# Altium schematic sheet Top.SchDoc
size B; DocumentNumber: 1; SheetNumber: 1; SheetTotal: 1
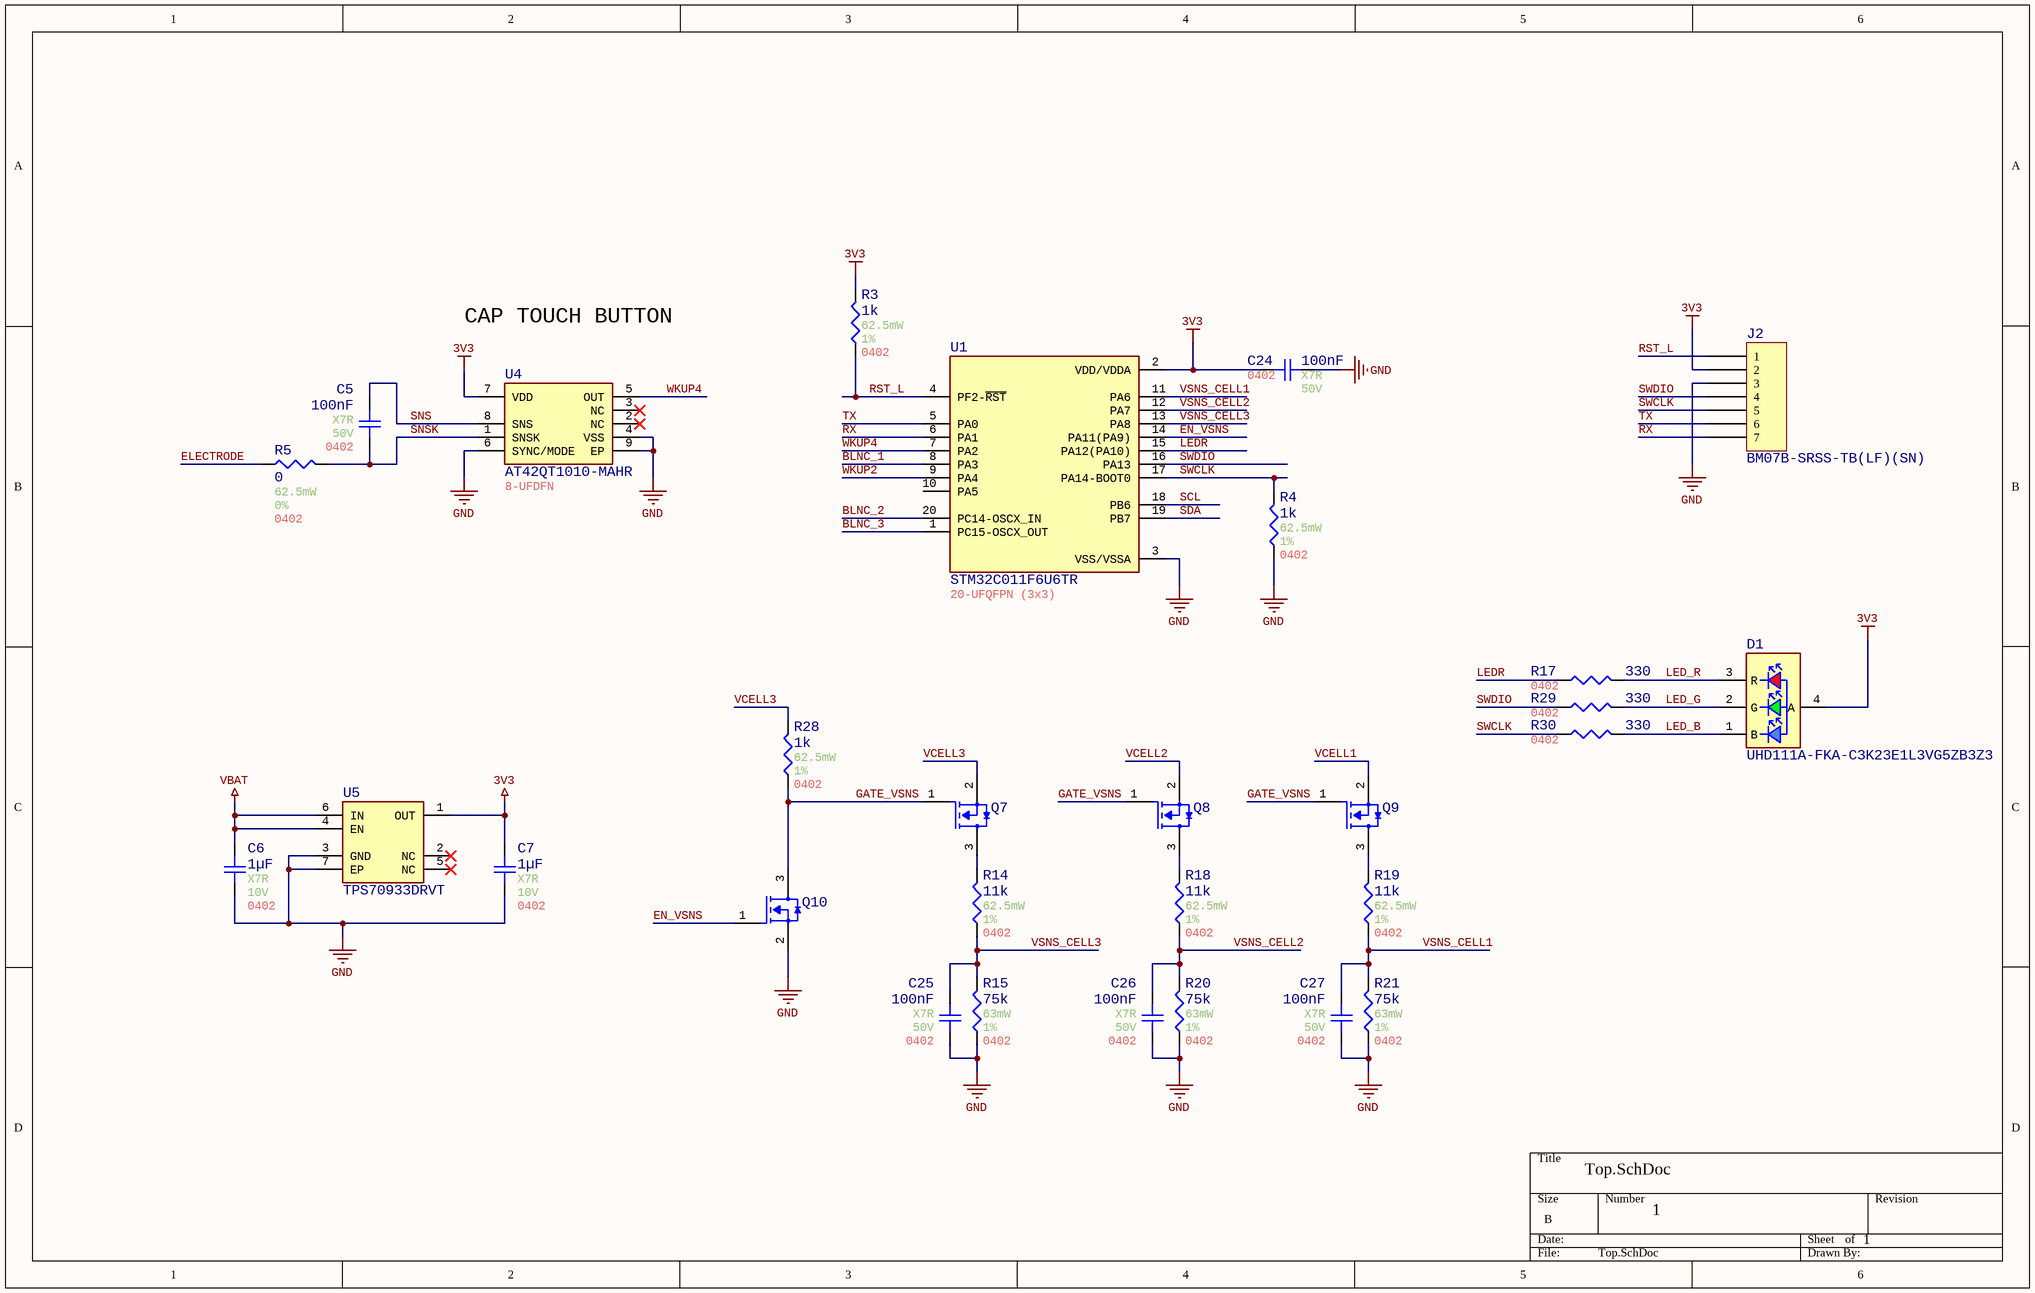
[diagram p0: Top.SchDoc]

## Parts
C5  value 100nF  Temperature Coefficient: X7R  Voltage Rating: 50V  Case/Package: 0402  [Generic 0402 capacitor]  (hidden comment: GRT155R71H104KE01D)
C6  value 1µF  Temperature Coefficient: X7R  Voltage Rating: 10V  Case/Package: 0402  [Generic 0402 capacitor]  (hidden comment: MAASL105CD7105MFCA01)
C7  value 1µF  Temperature Coefficient: X7R  Voltage Rating: 10V  Case/Package: 0402  [Generic 0402 capacitor]  (hidden comment: MAASL105CD7105MFCA01)
C24  value 100nF  Temperature Coefficient: X7R  Voltage Rating: 50V  Case/Package: 0402  [Generic 0402 capacitor]  (hidden comment: GRT155R71H104KE01D)
C25  value 100nF  Temperature Coefficient: X7R  Voltage Rating: 50V  Case/Package: 0402  [Generic 0402 capacitor]  (hidden comment: GRT155R71H104KE01D)
C26  value 100nF  Temperature Coefficient: X7R  Voltage Rating: 50V  Case/Package: 0402  [Generic 0402 capacitor]  (hidden comment: GRT155R71H104KE01D)
C27  value 100nF  Temperature Coefficient: X7R  Voltage Rating: 50V  Case/Package: 0402  [Generic 0402 capacitor]  (hidden comment: GRT155R71H104KE01D)
D1  UHD111A-FKA-C3K23E1L3VG5ZB3Z3  [UHD111A-FKA-C3K23E1L3VG5ZB3Z3]
J2  BM07B-SRSS-TB(LF)(SN)  [JST BM07B-SRSS-TB]
Q7  DMN61D9UWQ-7  [DMN61D9UWQ-7]  (value not drawn)
Q8  DMN61D9UWQ-7  [DMN61D9UWQ-7]  (value not drawn)
Q9  DMN61D9UWQ-7  [DMN61D9UWQ-7]  (value not drawn)
Q10  DMN61D9UWQ-7  [DMN61D9UWQ-7]  (value not drawn)
R3  value 1k  Power: 62.5mW  Tolerance: 1%  Case/Package: 0402  [Generic 0402 Resistor]  (hidden comment: WR04X1001FTL)
R4  value 1k  Power: 62.5mW  Tolerance: 1%  Case/Package: 0402  [Generic 0402 Resistor]  (hidden comment: WR04X1001FTL)
R5  value 0  Power: 62.5mW  Tolerance: 0%  Case/Package: 0402  [Generic 0402 Resistor]  (hidden comment: WR04X000PTL)
R14  value 11k  Power: 62.5mW  Tolerance: 1%  Case/Package: 0402  [Generic 0402 Resistor]  (hidden comment: RMCF0402FT11K0)
R15  value 75k  Power: 63mW  Tolerance: 1%  Case/Package: 0402  [Generic 0402 Resistor]  (hidden comment: WR04X7502FTL)
R17  value 330  Case/Package: 0402  [Generic 0402 Resistor]  (hidden comment: RMCF0402FT330R)
R18  value 11k  Power: 62.5mW  Tolerance: 1%  Case/Package: 0402  [Generic 0402 Resistor]  (hidden comment: RMCF0402FT11K0)
R19  value 11k  Power: 62.5mW  Tolerance: 1%  Case/Package: 0402  [Generic 0402 Resistor]  (hidden comment: RMCF0402FT11K0)
R20  value 75k  Power: 63mW  Tolerance: 1%  Case/Package: 0402  [Generic 0402 Resistor]  (hidden comment: WR04X7502FTL)
R21  value 75k  Power: 63mW  Tolerance: 1%  Case/Package: 0402  [Generic 0402 Resistor]  (hidden comment: WR04X7502FTL)
R28  value 1k  Power: 62.5mW  Tolerance: 1%  Case/Package: 0402  [Generic 0402 Resistor]  (hidden comment: WR04X1001FTL)
R29  value 330  Case/Package: 0402  [Generic 0402 Resistor]  (hidden comment: RMCF0402FT330R)
R30  value 330  Case/Package: 0402  [Generic 0402 Resistor]  (hidden comment: RMCF0402FT330R)
U1  STM32C011F6U6TR  [20-UFQFPN (3x3)]
U4  AT42QT1010-MAHR  Case/Package: 8-UFDFN  [AT42QT1010-MAHR]
U5  TPS70933DRVT  [WSON_6_2.0x2.0x0.8mm_0.65P]

## Nets
3V3: C7.2 C24.2 D1.4(A) J2.2 R3.2 U1.2(VDD/VDDA) U4.7(VDD) U5.1(OUT)
GND: C6.1 C7.1 C24.1 C25.1 C26.1 C27.1 J2.3 Q10.2(SOURCE) R4.1 R15.1 R20.1 R21.1 U1.3(VSS/VSSA) U4.4(VSS) U4.6(SYNC/MODE) U4.9(EP) U5.3(GND) U5.7(EP)
VBAT: C6.2 U5.4(EN) U5.6(IN)
BLNC_1: U1.8(PA3)
BLNC_2: U1.20(PC14-OSCX_IN)
BLNC_3: U1.1(PC15-OSCX_OUT)
ELECTRODE: R5.1
EN_VSNS: Q10.1(GATE) U1.14(PA11(PA9))
GATE_VSNS: Q7.1(GATE) Q8.1(GATE) Q9.1(GATE) Q10.3(DRAIN) R28.1
LED_B: D1.1(B) R30.2
LED_G: D1.2(G) R29.2
LED_R: D1.3(R) R17.2
LEDR: R17.1 U1.15(PA12(PA10))
RST_L: J2.1 R3.1 U1.4(PF2-~{RST})
RX: J2.7 U1.6(PA1)
SCL: U1.18(PB6)
SDA: U1.19(PB7)
SNS: C5.2 U4.8(SNS)
SNSK: C5.1 R5.2 U4.1(SNSK)
SWCLK: J2.5 R4.2 R30.1 U1.17(PA14-BOOT0)
SWDIO: J2.4 R29.1 U1.16(PA13)
TX: J2.6 U1.5(PA0)
VCELL1: Q9.2(SOURCE)
VCELL2: Q8.2(SOURCE)
VCELL3: Q7.2(SOURCE) R28.2
VSNS_CELL1: C27.2 R19.1 R21.2 U1.11(PA6)
VSNS_CELL2: C26.2 R18.1 R20.2 U1.12(PA7)
VSNS_CELL3: C25.2 R14.1 R15.2 U1.13(PA8)
WKUP2: U1.9(PA4)
WKUP4: U1.7(PA2) U4.5(OUT)
NetQ7_3: Q7.3(DRAIN) R14.2
NetQ8_3: Q8.3(DRAIN) R18.2
NetQ9_3: Q9.3(DRAIN) R19.2

Not connected (* = marked no-connect by the designer): U1 10(PA5); U4 2(NC)* 3(NC)*; U5 2(NC)* 5(NC)*

## Notes on the sheet
- CAP TOUCH BUTTON

## Library data of the parts
C5 C24-C27 = CMP-001-00084-12: Ceramic Capacitor, Multilayer, Ceramic, 50V, 10% +Tol, 10% -Tol, X7R, 15% TC, 0.1uF, Surface Mount, 0402; Multilayer: Yes; Terminal Finish: Nickel; Capacitor Type: Ceramic; Package Shape: Rectangular; Reach SVHC Compliant: Yes; Max Operating Temperature: 125°C; RoHS Compliant: Yes; Termination: Wraparound; Packaging: Tape and Reel; AECQ: Yes; Pins: 2; Dielectric Material: Ceramic; Min Operating Temperature: -55°C; Tolerance: 10%; Mounting Technology: Surface Mount
C6 C7 = CMP-001-00104-2: Cap Cer 1UF 20V X7T 0402; AECQ: Yes; Capacitor Type: Ceramic; Tolerance: 20%; Min Operating Temperature: -55°C; Max Operating Temperature: 125°C; Pins: 2; RoHS Compliant: Yes; Mounting Technology: Surface Mount
D1 = CMP-007-00049-1: LED Chip Blue/Green/Red 469nm/528nm/622nm 10A/10A/10A 4-Pin SMD T/R
J2 = BM07B-SRSS-TB(LF)(SN): CONN HEADER SMD 7POS 1MM; Manufacturer: JST Sales America Inc.; Current Rating (Amps): 0.7A; Material Flammability Rating: UL94 V-0; Number of Positions: 7; Number of Positions Loaded: All; Pitch - Mating: 0.039" (1.00mm); Shrouding: Shrouded - 4 Wall; Style: Board to Cable/Wire; Voltage Rating: 50V; Part Number: BM07B-SRSS-TB(LF)(SN); ComponentLink1Description: Datasheet; ComponentLink1URL: http://www.jst-mfg.com/product/pdf/eng/eSH.pdf; ComponentLink2Description: DigiKey Link; ComponentLink2URL: http://digikey.com/product-detail/en/jst-sales-america-inc/BM07B-SRSS-TB-LF-SN/455-1793-1-ND/926864; Connector Type: Header; Contact Finish - Mating: Tin; Contact Finish - Post: Tin; Contact Material: Copper Alloy; Contact Shape: Square; Contact Type: Male Pin; Fastening Type: Push-Pull; Features: Solder Retention; Insulation Color: Natural; Insulation Height: 0.167" (4.25mm); Insulation Material: Polyamide (PA), Nylon; LastUpdated: 1/12/2020 10:15:04 PM; Lifecycle Status: Active; Minimum Order: 1; Mounting Type: Surface Mount; Number of Rows: 1; Operating Temperature: -25°C ~ 85°C; Packaging: TapeAndReel; PartId: 22; Part Status: Active; Price: 0.42; Series: SR; Supplier 1: DigiKey; Supplier Part Number 1: 455-1793-1-ND; Termination: Solder
Q7-Q10 = CMP-013-00037-3: Small Signal Field-Effect Transistor; Transistor Type: n-FET; Min Operating Temperature: -55°C; Max Operating Temperature: 175°C; RoHS Compliant: Yes
R3 R4 R28 = CMP-009-00182-8: Fixed Resistor, Metal Glaze/thick Film, 0.0625W, 1000ohm, 50V, 1% +/-Tol, 100ppm/Cel, Surface Mount, 0402; Manufacturer Part Number: Blank; AECQ: No; Package Height: 0.35mm; Additional Feature: LASER TRIMMABLE; Rated Temperature: 70°C; Package Length: 1mm; Temperature Coefficient (ppm/Cel): 100; Package Width: 0.5mm; RoHS Compliant: Yes; Technology: METAL GLAZE/THICK FILM; Max Operating Temperature: 155°C; Mounting Technology: Surface Mount; JESD-609 Code: e3; Terminal Finish: Nickel; Working Voltage: 50V; Min Operating Temperature: -55°C; Pins: 2; Reach SVHC Compliant: Yes; Termination: Wraparound; Resistor Type: FIXED RESISTOR; Packaging: Tape and Reel; Package Shape: Rectangular; Construction: Chip
R5 = CMP-009-00186-8: Fixed Resistor, Metal Glaze/thick Film, 0.0625W, 0ohm, Surface Mount, 0402; Manufacturer Part Number: Blank; AECQ: No; Package Length: 1mm; Rated Temperature: 70°C; Package Height: 0.35mm; Package Width: 0.5mm; Resistor Type: FIXED RESISTOR; RoHS Compliant: Yes; Package Shape: Rectangular; Construction: Chip; Terminal Finish: Nickel; JESD-609 Code: e3; Pins: 2; Mounting Technology: Surface Mount; Technology: METAL GLAZE/THICK FILM; Termination: Wraparound; Reach SVHC Compliant: Yes; Min Operating Temperature: -55°C; Max Operating Temperature: 155°C; Packaging: Tape and Reel
R14 R18 R19 = CMP-009-00221-1: Res Thick Film 0402 11K Ohm 1% 0.063W(1/16W) ±100ppm/C Pad SMD Automotive T/R; AECQ: Yes; Pins: 2; RoHS Compliant: Yes; Max Operating Temperature: 155°C; Mounting Technology: Surface Mount; Min Operating Temperature: -55°C
R15 R20 R21 = CMP-009-00227-1: Res Thick Film 0402 75K Ohm 1% 0.063W(1/16W) ±100ppm/C Pad SMD T/R; AECQ: Yes; Max Operating Temperature: 155°C; Min Operating Temperature: -55°C; Pins: 2; Mounting Technology: SMD
R17 R29 R30 = CMP-009-00225-1: Res Thick Film 0402 330 Ohm 1% 0.063W ±100ppm/°C Molded SMD Paper T/R; Power: 62.5mW; AECQ: Yes; Tolerance: 1%; Mounting Technology: Surface Mount; Max Operating Temperature: 155°C; RoHS Compliant: Yes; Pins: 2; Min Operating Temperature: -55°C
U1 = CMP-020-00029-2: RISC Microcontroller, 32-Bit, FLASH, CORTEX-M4F CPU, 180MHz, CMOS, PBGA216; EEPROM Memory Size: 0B; Max Supply Voltage: 3.6V; Max Supply Current: 4.1mA; Clock Frequency: 48MHz; ADC Channels (Resolution): 13-Ch 12-Bit; Interface: I2C, I2S, SPI; Min Supply Voltage: 3V; Number of I/Os: 2; RAM Size: 6kB; Peripherals: POR, PWM; Case/Package: 20-UFQFPN (3x3); Height - Seated (Max): 600µm; Terminal Pitch: 500µm; Length: 3mm; Width: 3mm; Min Operating Temperature: -40°C; Max Operating Temperature: 85°C; Memory Format: FLASH; Operating Supply Voltage: 3V
U4 = CMP-010-00042-1: S-PDSO-N8 Buttons 1997 Tape & Reel (TR) capacitive touch sensor 2mm 378.5muA 14b 1.8V~5.5V; Min Supply Voltage: 1.8V; Max Supply Voltage: 5.5V; Pins: 8; Max Operating Temperature: 85°C; Min Operating Temperature: -40°C
U5 = CMP-019-00070-2: INTERSIL DG412DJZ Analogue Switch, SPST, 4 Channels, 35 ohm, 5V to 34V, DIP, 16 Pins; Output Voltage: 3.3V; Min Supply Voltage: 3.66V; Nominal Supply Current: 2µA; Max Supply Voltage: 28V; Output Current: 150mA; Case/Package: 6-WSON (2x2); Pins: 6; Max Operating Temperature: 125°C; RoHS Compliant: Yes; Min Operating Temperature: -40°C; Mounting Technology: SMT